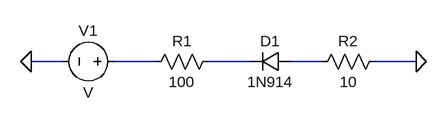
[diagram p0: schematic Draft1.asc]
Draft1.asc, the LTspice schematic file:
Version 4
SHEET 1 880 680
WIRE 96 128 48 128
WIRE 240 128 176 128
WIRE 384 128 320 128
WIRE 496 128 448 128
WIRE 640 128 576 128
FLAG 48 128 0
FLAG 640 128 0
SYMBOL voltage 192 128 R90
WINDOW 0 -32 56 VBottom 2
WINDOW 3 32 56 VTop 2
SYMATTR InstName V1
SYMBOL res 336 112 R90
WINDOW 0 0 56 VBottom 2
WINDOW 3 32 56 VTop 2
SYMATTR InstName R1
SYMATTR Value 100
SYMBOL diode 448 112 R90
WINDOW 0 0 32 VBottom 2
WINDOW 3 32 32 VTop 2
SYMATTR InstName D1
SYMATTR Value 1N914
SYMBOL res 592 112 R90
WINDOW 0 0 56 VBottom 2
WINDOW 3 32 56 VTop 2
SYMATTR InstName R2
SYMATTR Value 10

The netlist it stands for:
* Draft1.asc
V1 N001 0 V
R1 N002 N001 100
D1 N003 N002 1N914
R2 0 N003 10
.model D D
.lib standard.dio
.backanno
.end